# EAGLE design Dual 4-1 Mux (EAGLE 9.6.2)
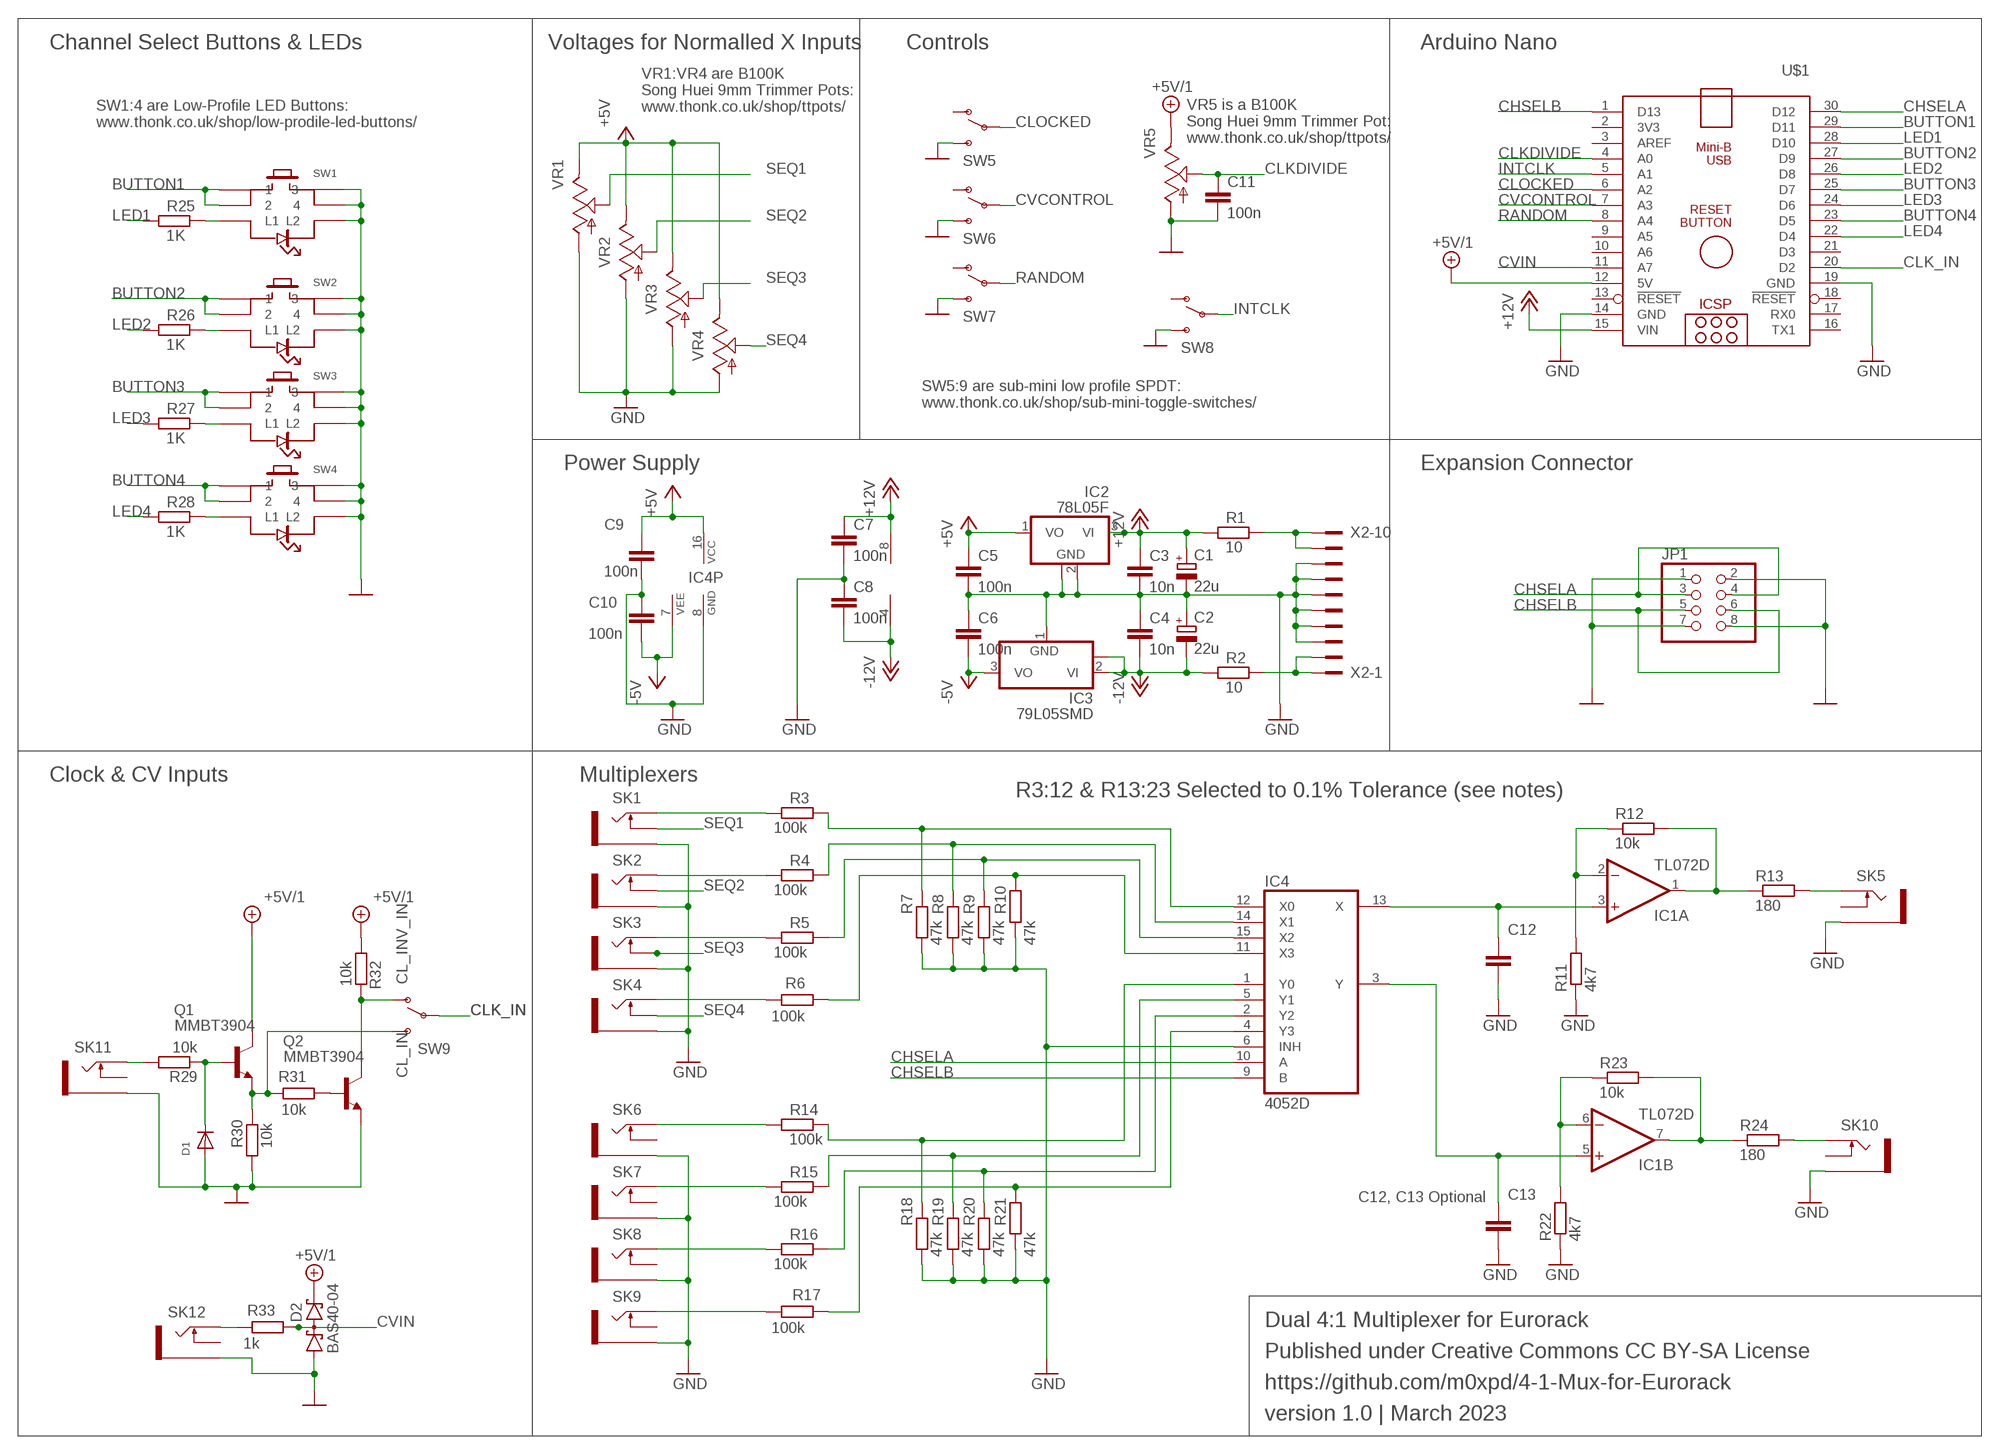
[diagram p0: schematic, sheet 1]

## Parts
C1  22u  CPOL-EU153CLV-0505  [153CLV-0505]
C2  22u  CPOL-EU153CLV-0505  [153CLV-0505]
C3  10n  C-EUC1206  [C1206]
C4  10n  C-EUC1206  [C1206]
C5  100n  C-EUC1206  [C1206]
C6  100n  C-EUC1206  [C1206]
C7  100n  C-EUC1206  [C1206]
C8  100n  C-EUC1206  [C1206]
C9  100n  C-EUC1206  [C1206]
C10  100n  C-EUC1206  [C1206]
C11  100n  C-EUC1206  [C1206]
C12  C-EUC1206  [C1206]
C13  C-EUC1206  [C1206]
D1  DIODESOD-323F  [SOD-323F]
D2  BAS40-04  [SOT23]
IC1  TL072D  [SO08]
IC2  78L05F  [SOT89]
IC3  79L05SMD  [SOT89]
IC4  4052D  [SO16]
JP1  PINHD-2X4  [2X04]
Q1  MMBT3904  [SOT23]
Q2  MMBT3904  [SOT23]
R1  10  R-EU_M1206  [M1206]
R2  10  R-EU_M1206  [M1206]
R3  100k  R-EU_M1206  [M1206]
R4  100k  R-EU_M1206  [M1206]
R5  100k  R-EU_M1206  [M1206]
R6  100k  R-EU_M1206  [M1206]
R7  47k  R-EU_M1206  [M1206]
R8  47k  R-EU_M1206  [M1206]
R9  47k  R-EU_M1206  [M1206]
R10  47k  R-EU_M1206  [M1206]
R11  4k7  R-EU_R1206  [R1206]
R12  10k  R-EU_R1206  [R1206]
R13  180  R-EU_M1206  [M1206]
R14  100k  R-EU_M1206  [M1206]
R15  100k  R-EU_M1206  [M1206]
R16  100k  R-EU_M1206  [M1206]
R17  100k  R-EU_M1206  [M1206]
R18  47k  R-EU_M1206  [M1206]
R19  47k  R-EU_M1206  [M1206]
R20  47k  R-EU_M1206  [M1206]
R21  47k  R-EU_M1206  [M1206]
R22  4k7  R-EU_R1206  [R1206]
R23  10k  R-EU_R1206  [R1206]
R24  180  R-EU_M1206  [M1206]
R25  1K  R-EU_M1206  [M1206]
R26  1K  R-EU_M1206  [M1206]
R27  1K  R-EU_M1206  [M1206]
R28  1K  R-EU_M1206  [M1206]
R29  10k  R-EU_R1206  [R1206]
R30  10k  R-EU_R1206  [R1206]
R31  10k  R-EU_R1206  [R1206]
R32  10k  R-EU_R1206  [R1206]
R33  1k  R-EU_M1206  [M1206]
SK1  THONKICONN_JACK  [WQP-PJ301M-12_JACK]
SK2  THONKICONN_JACK  [WQP-PJ301M-12_JACK]
SK3  THONKICONN_JACK  [WQP-PJ301M-12_JACK]
SK4  THONKICONN_JACK  [WQP-PJ301M-12_JACK]
SK5  THONKICONN_JACK  [WQP-PJ301M-12_JACK]
SK6  THONKICONN_JACK  [WQP-PJ301M-12_JACK]
SK7  THONKICONN_JACK  [WQP-PJ301M-12_JACK]
SK8  THONKICONN_JACK  [WQP-PJ301M-12_JACK]
SK9  THONKICONN_JACK  [WQP-PJ301M-12_JACK]
SK10  THONKICONN_JACK  [WQP-PJ301M-12_JACK]
SK11  THONKICONN_JACK  [WQP-PJ301M-12_JACK]
SK12  THONKICONN_JACK  [WQP-PJ301M-12_JACK]
SW1  THONK_LED_BUTTON  [LOW_PROFILE_BUTTON]
SW2  THONK_LED_BUTTON  [LOW_PROFILE_BUTTON]
SW3  THONK_LED_BUTTON  [LOW_PROFILE_BUTTON]
SW4  THONK_LED_BUTTON  [LOW_PROFILE_BUTTON]
SW5  SUBMINI_SPDT  [SUBMINI_TOGGLE]
SW6  SUBMINI_SPDT  [SUBMINI_TOGGLE]
SW7  SUBMINI_SPDT  [SUBMINI_TOGGLE]
SW8  SUBMINI_SPDT  [SUBMINI_TOGGLE]
SW9  SUBMINI_SPDT  [SUBMINI_TOGGLE]
U$1  ARDUINO_NANOARDUINO_NANO  [ARDUINO_NANO]
VR1  9MM_VERTICAL_POT  [9MM_SNAP-IN_POT]
VR2  9MM_VERTICAL_POT  [9MM_SNAP-IN_POT]
VR3  9MM_VERTICAL_POT  [9MM_SNAP-IN_POT]
VR4  9MM_VERTICAL_POT  [9MM_SNAP-IN_POT]
VR5  9MM_VERTICAL_POT  [9MM_SNAP-IN_POT]
X2  2510-  [PAK100/2500-10]

## Nets
+5V: C5.1 C9.1 IC2.1(VO) IC4.16(VCC) VR1.3(E) VR2.3(E) VR3.3(E) VR4.3(E)
+5V/1: D2.2(C2) Q1.3(C) R32.1 U$1.12(5V) VR5.3(E)
+12V: C1.+ C3.1 C7.1 IC1.8(P:V+) IC2.3(VI) R1.1 U$1.15(VIN)
-5V: C6.2 C10.2 IC3.3(VO) IC4.7(VEE)
-12V: C2.- C4.2 C8.2 IC1.4(P:V-) IC3.2(VI) IC3.2@1(VI) R2.1
BUTTON1: SW1.P$1 SW1.P$2 U$1.29(D11)
BUTTON2: SW2.P$1 SW2.P$2 U$1.27(D9)
BUTTON3: SW3.P$1 SW3.P$2 U$1.25(D7)
BUTTON4: SW4.P$1 SW4.P$2 U$1.23(D5)
CHSELA: IC4.10(A) JP1.3 JP1.4 U$1.30(D12)
CHSELB: IC4.9(B) JP1.5 JP1.6 U$1.1(D13)
CL_IN: Q1.2(E) R30.2 R31.2 SW9.3(S)
CL_INV_IN: Q2.3(C) R32.2 SW9.1(O)
CLK_IN: SW9.COM(COMMON) U$1.20(D2)
CLKDIVIDE: C11.1 U$1.4(A0) VR5.2(S)
CLOCKED: SW5.COM(COMMON) U$1.6(A2)
CVCONTROL: SW6.COM(COMMON) U$1.7(A3)
CVIN: D2.3(C1A2) R33.1 U$1.11(A7)
GND: C1.- C2.+ C3.2 C4.1 C5.2 C6.1 C7.2 C8.1 C9.2 C10.1 C11.2 C12.2 C13.2 D1.A D2.1(A1) IC2.2(GND) IC2.2@1(GND) IC3.1(GND) IC4.6(INH) IC4.8(GND) JP1.1 JP1.2 JP1.7 JP1.8 Q2.2(E) R7.1 R8.1 R9.1 R10.1 R11.1 R18.1 R19.1 R20.1 R21.1 R22.1 R30.1 SK1.P$3_SLEEVE(SLEEVE) SK2.P$3_SLEEVE(SLEEVE) SK3.P$3_SLEEVE(SLEEVE) SK4.P$3_SLEEVE(SLEEVE) SK5.P$3_SLEEVE(SLEEVE) SK6.P$3_SLEEVE(SLEEVE) SK7.P$3_SLEEVE(SLEEVE) SK8.P$3_SLEEVE(SLEEVE) SK9.P$3_SLEEVE(SLEEVE) SK10.P$3_SLEEVE(SLEEVE) SK11.P$3_SLEEVE(SLEEVE) SK12.P$3_SLEEVE(SLEEVE) SW1.L$2(L2) SW1.P$3 SW1.P$4 SW2.L$2(L2) SW2.P$3 SW2.P$4 SW3.L$2(L2) SW3.P$3 SW3.P$4 SW4.L$2(L2) SW4.P$3 SW4.P$4 SW5.3(S) SW6.3(S) SW7.3(S) SW8.3(S) U$1.14(GND) U$1.19(GND) VR1.1(A) VR2.1(A) VR3.1(A) VR4.1(A) VR5.1(A) X2.3 X2.4 X2.5 X2.6 X2.7 X2.8
INTCLK: SW8.COM(COMMON) U$1.5(A1)
LED1: R25.1 U$1.28(D10)
LED2: R26.1 U$1.26(D8)
LED3: R27.1 U$1.24(D6)
LED4: R28.1 U$1.22(D4)
N$1: IC4.12(X0) R3.2 R7.2
N$2: IC4.14(X1) R4.2 R8.2
N$3: IC4.15(X2) R5.2 R9.2
N$4: C12.1 IC1.3(A:+IN) IC4.13(X)
N$5: IC1.2(A:-IN) R11.2 R12.1
N$6: IC1.1(A:OUT) R12.2 R13.1
N$7: R3.1 SK1.P$1_TIP(TIP)
N$8: IC4.11(X3) R6.1 R10.2
N$9: R4.1 SK2.P$1_TIP(TIP)
N$10: R5.1 SK3.P$1_TIP(TIP)
N$11: R6.2 SK4.P$1_TIP(TIP)
N$12: R25.2 SW1.L$1(L1)
N$13: R13.2 SK5.P$1_TIP(TIP)
N$14: IC4.1(Y0) R14.2 R18.2
N$15: R1.2 X2.9 X2.10
N$16: R2.2 X2.1 X2.2
N$17: IC4.5(Y1) R15.2 R19.2
N$18: IC4.2(Y2) R16.2 R20.2
N$19: IC4.4(Y3) R17.1 R21.2
N$20: R14.1 SK6.P$1_TIP(TIP)
N$21: R15.1 SK7.P$1_TIP(TIP)
N$22: R16.1 SK8.P$1_TIP(TIP)
N$23: R17.2 SK9.P$1_TIP(TIP)
N$24: D1.C Q1.1(B) R29.1
N$25: C13.1 IC1.5(B:+IN) IC4.3(Y)
N$26: IC1.6(B:-IN) R22.2 R23.1
N$27: IC1.7(B:OUT) R23.2 R24.1
N$28: R24.2 SK10.P$1_TIP(TIP)
N$29: R26.2 SW2.L$1(L1)
N$30: R33.2 SK12.P$1_TIP(TIP)
N$31: Q2.1(B) R31.1
N$32: R27.2 SW3.L$1(L1)
N$33: R29.2 SK11.P$1_TIP(TIP)
N$34: R28.2 SW4.L$1(L1)
RANDOM: SW7.COM(COMMON) U$1.8(A4)
SEQ1: SK1.P$2_SWITCH(SWITCH) VR1.2(S)
SEQ2: SK2.P$2_SWITCH(SWITCH) VR2.2(S)
SEQ3: SK3.P$2_SWITCH(SWITCH) VR3.2(S)
SEQ4: SK4.P$2_SWITCH(SWITCH) VR4.2(S)
Unconnected: SK5.P$2_SWITCH(SWITCH) SK6.P$2_SWITCH(SWITCH) SK7.P$2_SWITCH(SWITCH) SK8.P$2_SWITCH(SWITCH) SK9.P$2_SWITCH(SWITCH) SK10.P$2_SWITCH(SWITCH) SK11.P$2_SWITCH(SWITCH) SK12.P$2_SWITCH(SWITCH) SW5.1(O) SW6.1(O) SW7.1(O) SW8.1(O) U$1.2(3V3) U$1.3(AREF) U$1.9(A5) U$1.10(A6) U$1.13(!RESET) U$1.16(TX1) U$1.17(RX0) U$1.18(!RESET) U$1.21(D3)

## Notes on the sheet
- Channel Select Buttons & LEDs | Voltages for Normalled X Inputs | Controls | Arduino Nano
- VR1:VR4 are B100K 
  Song Huei 9mm Trimmer Pots:
  www.thonk.co.uk/shop/ttpots/
- SW1:4 are Low-Profile LED Buttons:
  www.thonk.co.uk/shop/low-prodile-led-buttons/
- VR5 is a B100K 
  Song Huei 9mm Trimmer Pot:
  www.thonk.co.uk/shop/ttpots/
- SW5:9 are sub-mini low profile SPDT:
  www.thonk.co.uk/shop/sub-mini-toggle-switches/
- Power Supply | Expansion Connector
- Clock & CV Inputs | Multiplexers
- R3:12 & R13:23 Selected to 0.1% Tolerance (see notes)
- C12, C13 Optional
- Dual 4:1 Multiplexer for Eurorack
- Published under Creative Commons CC BY-SA License
- https://github.com/m0xpd/4-1-Mux-for-Eurorack
- version 1.0 | March 2023

## Library data of the parts
C1 C2 = rcl:CPOL-EU: POLARIZED CAPACITOR, European symbol; SPICEPREFIX: C
C3-C13 = rcl:C-EU: CAPACITOR, European symbol; SPICEPREFIX: C
D1 = adafruit:DIODE: Diode SMADIODE - SMA Surface Mount Package 20V 1A Schottky Diode Digikey: 641-1014-6-ND DO-1N4148 - Through Hole Small Current Diode SOD-123 20V 1 A (.5mV Vf) Schottky Diode - Digikey: MBRX120TPMSCT-ND SOD-323 10V 570mA (.38mV Vf, 3ns) Schottky Diode - Digikey: ZLLS410CT-ND SOD-523 30V 30mA Schottky Diode (RB751S-40TE61) - Digikey: RB751S-40TE61CT-ND SOT23-R/W - SOT23 Package (R = Solder Paste/Reflow Ovens, W = Hand-Soldering) BAT54Film 40V 300mA - Digikey: 497-7162-1-ND
D2 = diode:BAS40-04: Silicon Schottky Diodes General-purpose diode for high-speed switching
IC1 = linear:TL072: OP AMP
IC2 = linear:78L*: POSITOIV-VOLTAGE REGULATORS Output up to 100 mA Source: Datasheet <http://focus.ti.com/lit/ds/symlink/ua78l05.pdf>
IC3 = MyLibrary:79L05SMD: -5V Linear Regulator with 100mA output in SOT-89 Package
IC4 = 40xx:4052: Dual 4-channel ANALOG MULTIPLEXER
JP1 = pinhead:PINHD-2X4: PIN HEADER
Q1 Q2 = MyLibrary:MMBT3904: SMD Version of the 2N3904 in SOT23 Package
R1-R33 = rcl:R-EU_: RESISTOR, European symbol; SPICEPREFIX: R
SK1-SK12 = MyLibrary:THONKICONN_JACK
SW1-SW4 = MyLibrary:THONK_LED_BUTTON: Sleek low-profile illuminated button with a choice of LED colours https://www.thonk.co.uk/shop/low-profile-led-buttons/
SW5-SW9 = MyLibrary:SUBMINI_SPDT: Subminuature SPDT Toggle, THONK DW1
U$1 = MyLibrary:ARDUINO_NANO: Arduino Nano with un-cluttered footprint
VR1-VR5 = MyLibrary:9MM_VERTICAL_POT
X2 = con-3m:2510-: 3M (TM) Pak 100 4-Wall Header Source: 3M; MF: 3M; MPN: 2510-6002UB; OC_FARNELL: 9838244; OC_NEWARK: 46F4725

## Board
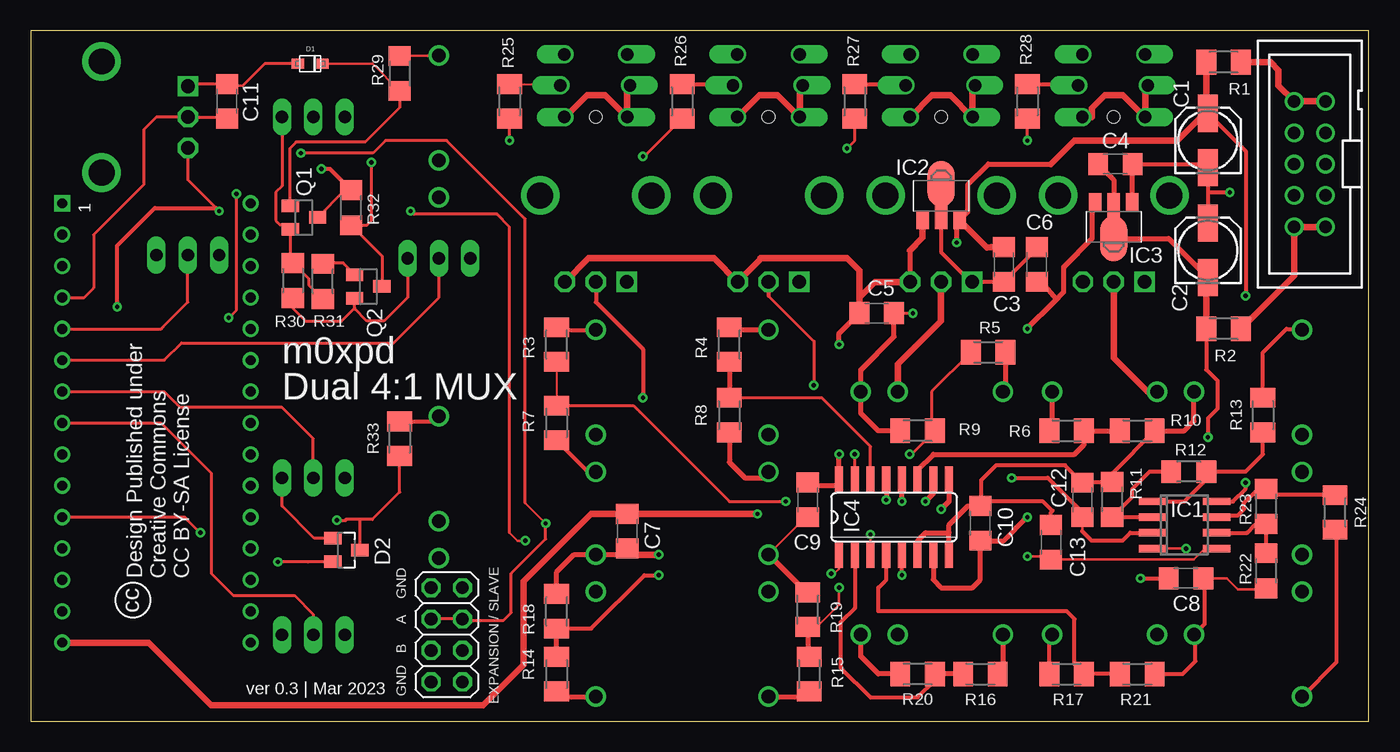
[diagram p1: board, top side]
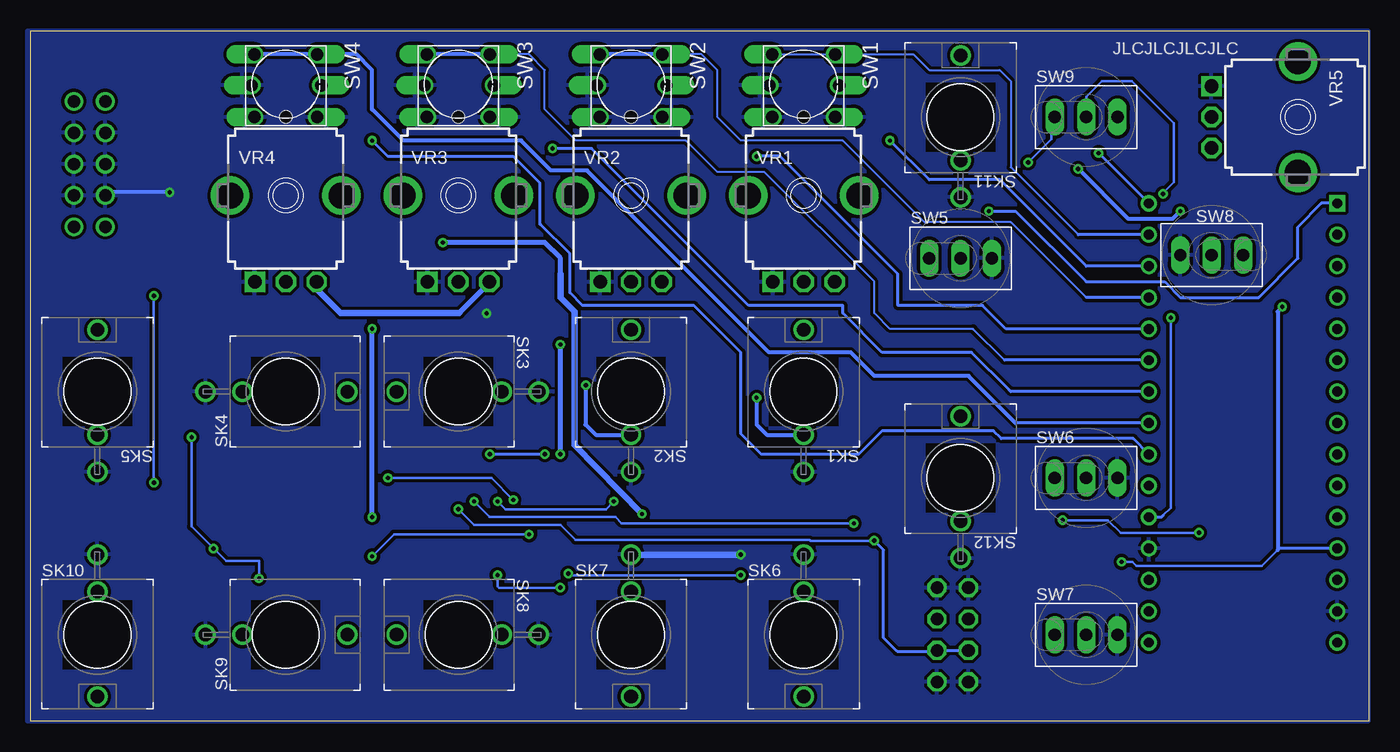
[diagram p2: board, bottom side, seen from below]

Size 108.25 x 55.87 mm. Coordinates in mm from the lower left corner, seen from the top.
Outline: 0,0 108.25,0 108.25,55.87 0,55.87 0,0
Copper layers (1*16): Top 0.035mm / dielectric 1.5mm / Bottom 0.035mm
Design rules "default *": minimum track width 6mil, minimum drill 0.35mm, track to track 10mil, track to pad 10mil, pad to pad 6mil, via to via 6mil, smd to smd 6mil, copper to edge 0mil, drill to drill 6mil, minimum pad ring 10mil, minimum via ring 8mil, stop-mask expansion 4mil, vias tented up to drill 0mil, thermal gap 10mil

### Footprints (pad centres in the part's own frame; a part is rotated, then mirrored left to right if it is on the bottom)
153CLV-0505 = smd 3 x 1.6: + 2.2,0; - -2.2,0
C1206 = smd 1.6 x 1.8: 1 -1.4,0; 2 1.4,0
SOD-323F = smd 1 x 0.8: A -1,0; C 1,0
SOT23 = smd 1 x 1.4: 1 -0.95,-1.1; 2 0.95,-1.1; 3 0,1.1
SO08 = smd 0.6 x 2.2: 1 -1.905,-2.6; 2 -0.635,-2.6; 3 0.635,-2.6; 4 1.905,-2.6; 5 1.905,2.6; 6 0.635,2.6; 7 -0.635,2.6; 8 -1.905,2.6
SOT89 = smd 1 x 1.5: 1 -1.499,-1.981; 3 1.499,-1.981 | smd 1 x 2: 2 0,-1.727 | smd 2.2 x 3.7: 2@1 0,0.94
SO16 = smd 0.66 x 2.032: 1 -4.445,-3.073; 2 -3.175,-3.073; 3 -1.905,-3.073; 4 -0.635,-3.073; 5 0.635,-3.073; 6 1.905,-3.073; 7 3.175,-3.073; 8 4.445,-3.073; 9 4.445,3.073; 10 3.175,3.073; 11 1.905,3.073; 12 0.635,3.073; 13 -0.635,3.073; 14 -1.905,3.073; 15 -3.175,3.073; 16 -4.445,3.073
2X04 = drill 1.016 octagon: 1 -3.81,-1.27; 2 -3.81,1.27; 3 -1.27,-1.27; 4 -1.27,1.27; 5 1.27,-1.27; 6 1.27,1.27; 7 3.81,-1.27; 8 3.81,1.27
M1206 = smd 1.6 x 2: 1 -1.4,0; 2 1.4,0
R1206 = smd 1.6 x 1.803: 1 -1.422,0; 2 1.422,0
WQP-PJ301M-12_JACK = drill 1.1: P$1_TIP 0,5; P$2_SWITCH 0,-3.5; P$3_SLEEVE 0,-6.5
LOW_PROFILE_BUTTON = drill 1 offset: L$1 -2.875,-0.02; L$2 2.76,-0.02; P$1 2.54,-2.54; P$2 -2.54,-2.54; P$3 2.54,2.54; P$4 -2.54,2.54 | hole 1: 0,2.54
SUBMINI_TOGGLE = drill 1 pad 1.422 long: 1 -2.54,0; 3 2.54,0; COM 0,0
ARDUINO_NANO = drill 0.8 square: 1 -20.32,-7.62 | drill 0.8: 2 -17.78,-7.62; 3 -15.24,-7.62; 4 -12.7,-7.62; 5 -10.16,-7.62; 6 -7.62,-7.62; 7 -5.08,-7.62; 8 -2.54,-7.62; 9 0,-7.62; 10 2.54,-7.62; 11 5.08,-7.62; 12 7.62,-7.62; 13 10.16,-7.62; 14 12.7,-7.62; 15 15.24,-7.62; 16 15.24,7.62; 17 12.7,7.62; 18 10.16,7.62; 19 7.62,7.62; 20 5.08,7.62; 21 2.54,7.62; 22 0,7.62; 23 -2.54,7.62; 24 -5.08,7.62; 25 -7.62,7.62; 26 -10.16,7.62; 27 -12.7,7.62; 28 -15.24,7.62; 29 -17.78,7.62; 30 -20.32,7.62
9MM_SNAP-IN_POT = drill 1.1 square: 1 -2.5,-7 | drill 1.1 octagon: 2 0,-7; 3 2.5,-7 | drill 2.1 pad 2.794: CH1 -4.5,0; CH2 4.5,0
PAK100/2500-10 = drill 1 pad 1.422: 1 -5.08,-1.27; 2 -5.08,1.27; 3 -2.54,-1.27; 4 -2.54,1.27; 5 0,-1.27; 6 0,1.27; 7 2.54,-1.27; 8 2.54,1.27; 9 5.08,-1.27; 10 5.08,1.27

### Placement (x,y rotation side)
C1  95.25,46.99 90 top
C2  95.25,38.1 90 top
C3  78.74,36.96 270 top
C4  87.76,45.09 180 top
C5  68.45,33.02 0 top
C6  81.41,36.96 270 top
C7  48.26,15.37 270 top
C8  93.47,11.56 180 top
C9  62.87,17.91 270 top
C10  76.83,16 270 top
C11  15.88,50.16 90 top
C12  85.09,17.9 90 top
C13  82.55,14.47 90 top
D1  22.61,53.21 0 top
D2  25.53,13.84 270 top
IC1  93.34,15.88 270 top
IC2  73.66,42.55 0 top
IC3  87.63,40.01 180 top
IC4  69.85,16.51 0 top
JP1  33.66,6.99 270 top
Q1  22.1,40.77 270 top
Q2  27.3,35.18 270 top
R1  96.52,53.34 0 top
R2  96.52,31.75 0 top
R3  42.55,30.48 270 top
R4  56.52,30.48 270 top
R5  77.47,29.84 180 top
R6  83.82,23.5 180 top
R7  42.55,24.13 90 top
R8  56.52,24.77 90 top
R9  71.75,23.5 0 top
R10  89.53,23.5 180 top
R11  87.5,17.93 270 top
R12  93.7,20.19 0 top
R13  99.69,24.77 90 top
R14  42.55,3.81 90 top
R15  62.99,3.81 90 top
R16  76.83,3.81 180 top
R17  83.82,3.81 180 top
R18  42.55,8.89 270 top
R19  62.87,9.02 270 top
R20  71.75,3.81 0 top
R21  89.53,3.81 180 top
R22  99.95,12.17 90 top
R23  99.95,17.37 90 top
R24  105.54,16.89 270 top
R25  38.73,50.16 90 top
R26  52.7,50.16 90 top
R27  66.67,50.16 90 top
R28  80.64,50.16 90 top
R29  29.84,52.43 90 top
R30  21.21,35.66 90 top
R31  23.62,35.59 270 top
R32  25.91,41.55 270 top
R33  29.84,22.86 90 top
SK1  45.72,26.67 0 bottom
SK2  59.69,26.67 0 bottom
SK3  73.66,26.67 90 bottom
SK4  87.63,26.67 270 bottom
SK5  102.87,26.67 0 bottom
SK6  45.72,6.99 180 bottom
SK7  59.69,6.99 180 bottom
SK8  73.66,6.99 90 bottom
SK9  87.63,6.99 270 bottom
SK10  102.87,6.99 180 bottom
SK11  33.02,48.9 0 bottom
SK12  33.02,19.68 0 bottom
SW1  45.72,51.44 180 bottom
SW2  59.69,51.44 180 bottom
SW3  73.66,51.44 180 bottom
SW4  87.63,51.44 180 bottom
SW5  33.02,37.47 0 bottom
SW6  22.86,19.68 0 bottom
SW7  22.86,6.99 0 bottom
SW8  12.7,37.72 180 bottom
SW9  22.86,48.9 0 bottom
U$1  10.16,21.59 270 top
VR1  45.72,42.55 0 bottom
VR2  59.69,42.55 0 bottom
VR3  73.66,42.55 0 bottom
VR4  87.63,42.55 0 bottom
VR5  5.71,48.9 270 bottom
X2  103.5,45.09 90 top

### Tracks (layer width: path | path; a pad name or v marks a point on that pad's centre or on a via)
+5V  (via drill 0.35)
  Top 0.406: 71.12,38.1 71.12,35.59 VR3.3 | C5.1 65.41,31.38 v65.41,30.48 | 65.41,19.94 v65.41,21.59 | C9.1 63.12,19.05 65.41,19.05
  Top 0.508: VR3.3 68.31,35.55 67.05,34.29 C5.1 67.05,36.45 66.04,37.47 59.05,37.47 59.05,37.41 VR2.3 55.27,37.47 45.14,37.47 VR1.3 | IC2.1 72.16,39.14 71.12,38.1 | 65.41,19.94 IC4.16 65.41,19.05
  Bottom 0.406: 73.61,33.02 71.16,35.47 VR3.3 | v65.41,21.59 v65.41,30.48
  Bottom 0.508: VR4.3 85.13,34.97 83.19,33.02 73.61,33.02
+5V/1  (via drill 0.35)
  Top 0.152: 22.42,12.89 22.41,12.88 | 25.41,42.98 R32.1
  Top 0.203: 14.99,41.53 v15.24,41.27 | 25.87,43.01 R32.1 | 20.12,13.01 v19.99,12.88
  Top 0.254: v15.24,41.27 12.71,43.8 VR5.3 | 22.41,12.88 v19.99,12.88 | D2.2 22.42,12.89 | Q1.3 25.41,42.98
  Top 0.305: v6.99,33.53 6.99,38.48 10.03,41.53 14.99,41.53 | v23.5,44.7 24.18,44.7 25.87,43.01
  Bottom 0.203: v19.99,12.88 19.11,12.88 18.8,12.57 8.64,12.57 7.37,13.84
  Bottom 0.254: U$1.12 7.24,13.97 7.37,13.84
  Bottom 0.305: 7.37,13.84 7.37,33.15 v6.99,33.53 | v15.24,41.27 15.88,40.64 19.43,40.64 v23.5,44.7
+12V  (via drill 0.35)
  Top 0.152: 74.93,40.34 IC2.3
  Top 0.305: C1.+ 98.3,46.14 v98.3,34.42 | IC1.8 97.28,17.78 98.3,18.8 v98.3,19.3
  Top 0.406: 82.55,45.09 77.47,45.09 75.79,43.41 75.79,41.2 IC2.3 | v74.93,38.73 74.93,40.34
  Top 0.508: R1.1 95.12,49.32 | 95.12,49.32 C1.+ | 82.55,45.09 84.45,46.99 92.79,46.99 95.12,49.32 | IC2.3 77.38,38.34 77.72,38.36 C3.1 | v58.8,16.77 C7.1 45.34,16.77 39.88,11.3 39.88,4.57 36.58,1.27 14.61,1.27 9.53,6.35 U$1.15
  Bottom 0.203: v98.3,34.42 v98.3,19.3
  Bottom 0.406: 65.41,36.2 65.41,37.47 66.67,38.73 v74.93,38.73
  Bottom 0.508: 65.41,36.2 65.41,34.29 64.26,33.15 64.26,22.37 v58.8,16.77
-5V  (via drill 0.35)
  Top 0.406: IC3.3 85.88,41.73 85.88,39.06 83.58,36.77 83.57,36.78 83.57,34.72 82.78,33.93 | C6.2 81.89,35.48 83,34.16 82.78,33.93 | v80.64,16.51 78.74,14.61 C10.2 76.83,11.43 76.2,10.79 73.66,10.79 73.03,11.43 IC4.7 | 82.78,33.93 80.64,31.8 v80.64,31.75
  Bottom 0.406: v80.64,16.51 v80.64,31.75
-12V  (via drill 0.35)
  Top 0.203: v95.25,22.99 95.25,22.86 | v93.47,13.97 IC1.4
  Top 0.305: R2.1 95.12,28.45 96.01,27.56 96.01,25.27 95.25,24.51 v95.25,22.99 | v89.79,11.56 C8.2
  Top 0.406: C2.- 92.08,39.06 IC3.2@1 IC3.2 87.63,43.81 C4.2
  Top 0.508: R2.1 95.12,35.77 C2.-
  Bottom 0.203: v95.25,22.99 95.25,15.75 v93.47,13.97 92.46,12.95 89.79,12.95 v89.79,11.56
BUTTON1
  Bottom 0.152: SW1.P$1 SW1.P$2 36.83,53.98 35.56,52.7 29.84,52.7 28.96,51.82 28.96,44.83 23.5,39.37
  Bottom 0.254: U$1.29 23.5,39.37
BUTTON2
  Bottom 0.152: 22.86,34.29 28.96,40.39 35.94,40.39 42.55,46.99 50.8,46.99 52.7,48.9 52.7,52.7 53.98,53.98 SW2.P$2
  Bottom 0.254: U$1.27 22.86,34.29
  Bottom 0.305: SW2.P$2 SW2.P$1
BUTTON3
  Bottom 0.152: 32,31.75 38.73,31.75 40.01,33.02 40.01,35.56 48.9,44.45 52.7,44.45 55.24,46.99 64.14,46.99 66.67,49.53 66.67,52.7 67.94,53.98 SW3.P$2
  Bottom 0.203: 29.46,29.21 32,31.75
  Bottom 0.254: U$1.25 29.46,29.21
  Bottom 0.305: SW3.P$2 SW3.P$1
BUTTON4
  Bottom 0.254: U$1.23 28.57,24.13
  Bottom 0.305: 28.57,24.13 32.38,27.94 40.01,27.94 41.91,29.84 48.51,29.84 63.25,44.58 66.17,44.58 68.58,46.99 78.11,46.99 80.64,49.53 80.64,52.7 81.92,53.98 SW4.P$2 SW4.P$1
CHSELA  (via drill 0.35)
  Top 0.152: 35.05,8.13 JP1.4
  Top 0.203: v41.66,16 40.01,17.65
  Top 0.254: 40.01,17.65 40.01,40.64 33.66,46.99 28.7,46.99 27.69,45.97 v21.84,45.97 | v41.66,16 41.66,14.73 38.86,11.94 38.86,8.76 38.23,8.13 35.05,8.13 | JP1.4 JP1.3
  Top 0.406: IC4.10 73.03,18.41 v72.39,17.78
  Bottom 0.203: v72.39,17.78 71.12,16.51 60.96,16.51 60.45,16 v41.66,16
  Bottom 0.254: U$1.30 v21.84,45.97
CHSELB  (via drill 0.35)
  Top 0.203: v40.01,14.61 39.37,14.61 38.73,15.24
  Top 0.254: 38.73,15.24 38.73,40.01 37.72,41.02 30.99,41.02 v30.73,41.27
  Top 0.406: IC4.9 74.3,17.78 v73.66,17.14
  Bottom 0.152: 38.1,5.59 38.16,5.65 | 34.99,5.65 JP1.6
  Bottom 0.203: v73.66,17.14 72.39,15.88 65.41,15.88 64.2,14.67 45.23,14.67 45.17,14.61 v40.01,14.61
  Bottom 0.254: v30.73,41.27 28.57,41.27 22.86,35.56 16.51,35.56 15.24,34.29 8.89,34.29 5.71,37.47 5.71,40.01 3.81,41.91 U$1.1 | v40.01,14.61 39.24,13.84 39.24,6.73 38.16,5.65 34.99,5.65 | JP1.6 JP1.5
CL_IN
  Top 0.152: 21,37.55 21.34,37.21
  Top 0.203: 21.53,37.41 21.34,37.21 R30.2
  Top 0.254: R30.2 22.48,35.81 22.48,35.31 R31.2 | SW9.3 20.32,43.31 19.81,42.8 19.81,40.51 20,40.32 20.13,40.2 20.62,40.2 Q1.2 21,37.55
CL_INV_IN  (via drill 0.35)
  Top 0.254: v27.56,45.21 27.56,40.51 27.18,40.13 R32.2 28.41,37.63 Q2.3
  Bottom 0.203: SW9.1 25.65,48.64 25.65,47.12 v27.56,45.21
CLK_IN  (via drill 0.35)
  Top 0.203: v16.64,42.67 16.68,42.71
  Top 0.254: v16,32.64 16.64,33.27 v16.64,42.67
  Bottom 0.203: 16.64,16.64 16,17.27 v16,32.64 | v16.64,42.67 16.64,42.76 15.77,43.62 15.77,48.41 19.18,51.82 21.59,51.82 22.86,50.55 SW9.COM
  Bottom 0.254: 16.64,16.64 16.76,16.51 U$1.20
CLKDIVIDE
  Top 0.203: 15.74,48.9 C11.1
  Top 0.254: 15.74,48.9 VR5.2 10.16,48.9 9.14,47.88 9.14,43.43 5.08,39.37 5.08,35.05 4.32,34.29 U$1.4
CLOCKED
  Top 0.254: SW5.COM 33.02,34.29 29.34,30.61 12.19,30.61 10.79,29.21 U$1.6
CVCONTROL
  Top 0.254: SW6.COM 22.86,22.86 20.32,25.4 12.06,25.4 10.79,26.67 U$1.7
CVIN  (via drill 0.35)
  Top 0.152: 26.63,16.27 26.67,16.31
  Top 0.203: v13.72,15.24 | 25.53,16.26 25.47,16.31
  Top 0.254: R33.1 29.84,18.54 27.61,16.31 26.67,16.31 25.47,16.31 | v13.72,15.24 12.57,16.38 12.45,16.51 U$1.11 | v24.77,16.26 25.53,16.26 | D2.3 26.63,16.27
  Bottom 0.203: v13.72,15.24 20.07,15.24 21.08,16.26 v24.77,16.26
GND  (via drill 0.35)
  Top 0.152: C3.2 78.72,35.55 | 80.9,37.72 80.9,38.1 81.16,38.36 C6.1 | C7.2 48.77,13.46
  Top 0.203: SK7.P$3_SLEEVE 62.72,16.51 C9.2 | C12.2 85.14,19.35 | 87.5,20.06 R11.1 | 82.55,16.89 82.68,17.02 | 77.08,17.78 76.89,17.59 76.71,17.41 | C8.1 95,11.56 96.77,11.56 97.66,10.67 99.87,10.67 R22.1 | SK9.P$3_SLEEVE 94.25,7.1 | R30.1 21.21,33.4 | 12.88,51.56 VR5.1 | 17.14,51.44 16,51.44 C11.2
  Top 0.254: 21.21,33.4 22.23,32.38 25.15,32.38 26.23,33.47 26.23,33.33 | C11.2 12.88,51.56 | D1.A 18.92,53.21 17.14,51.44 | SW5.3 30.48,34.29 28.57,32.38 27.18,32.38 26.23,33.33 | 76.09,35.55 VR3.1 | C5.2 v71.37,33.02 | D2.1 22.93,14.79 20.32,17.4 SW6.3 | 26.23,33.33 26.2,33.36 Q2.2
  Top 0.305: R7.1 45.1,20.17 SK1.P$3_SLEEVE | 85.14,19.35 R11.1 | R10.1 87.5,20.06 | C13.2 82.55,16.89 | 82.68,17.02 81.92,17.78 77.08,17.78 | C12.2 83.69,20.7 78.11,20.7 76.89,19.49 76.89,17.59 | 95,11.56 95,7.85 94.25,7.1 94.25,4.84 93.22,3.81 R21.1 | IC2.2 73.66,37.97 76.09,35.55 78.72,35.55 | C4.1 94.95,45.09 C1.- 95.25,42.67 | 95.25,42.67 C2.+ | 95.25,42.67 95.38,42.8 v97.03,42.8 | C3.2 80.9,37.72
  Top 0.406: IC3.1 89.13,45.05 C4.1 | IC4.8 74.3,15.24 | 74.3,15.24 74.3,15.88 75.83,17.41 76.71,17.41 C10.1 | R18.1 42.55,12.06 43.97,13.48 SK6.P$3_SLEEVE 47.56,13.48 C7.2 | SK7.P$3_SLEEVE 62.76,10.42 R19.1 | R20.1 68.58,3.81 67.16,5.23 SK8.P$3_SLEEVE | IC4.6 71.75,14.61 72.39,15.24 74.3,15.24 | R8.1 56.52,20.95 57.78,19.68 59.2,19.68 SK2.P$3_SLEEVE | R9.1 68.58,23.5 67.16,24.91 SK3.P$3_SLEEVE 67.16,28.43 69.85,31.11 C5.2 | R10.1 93.34,23.5 94.13,24.28 SK4.P$3_SLEEVE | IC2.2 IC2.2@1
  Top 0.508: SW4.P$4 85.86,48.9 85.86,49.63 86.9,50.66 88.36,50.66 90.13,48.9 SW4.P$3 90.17,51.23 SW4.L$2 | SW3.P$4 71.16,48.9 72.93,50.66 74.39,50.66 76.16,48.9 SW3.P$3 76.2,51.23 SW3.L$2 | SW2.P$4 57.19,48.9 58.96,50.66 60.42,50.66 62.19,48.9 SW2.P$3 62.23,51.23 SW2.L$2 | SW1.P$4 43.22,48.9 44.99,50.66 46.45,50.66 48.22,48.9 SW1.P$3 48.26,51.23 SW1.L$2 | 48.77,13.46 v50.8,13.46
  Bottom 0.152: 59.67,13.46 SK7.P$3_SLEEVE | 33.02,13.08 SK12.P$3_SLEEVE
  Bottom 0.305: v97.03,42.8 101.98,42.8 X2.4
  Bottom 0.508: v50.8,13.46 59.67,13.46
  pour Bottom: 0,0 0,55.88 108.58,55.88 108.58,0
INTCLK
  Top 0.254: SW8.COM 12.7,33.91 10.67,31.88 10.54,31.75 U$1.5
LED1  (via drill 0.35)
  Top 0.254: v38.73,46.99 R25.1
  Bottom 0.254: v38.73,46.99 35.56,43.81 29.84,43.81 22.86,36.83 U$1.28
LED2  (via drill 0.35)
  Top 0.152: 49.66,45.72 v49.53,45.72
  Top 0.254: 49.66,45.72 R26.1
  Bottom 0.254: v49.53,45.72 47.62,45.72 38.1,36.2 38.1,33.66 31.24,33.66 29.34,31.75 U$1.26
LED3  (via drill 0.35)
  Top 0.254: v66.04,46.35 66.67,46.99 R27.1
  Bottom 0.254: v66.04,46.35 62.87,46.35 50.16,33.66 42.55,33.66 42.55,33.02 39.37,29.84 32.13,29.84 29.08,26.8 28.96,26.67 U$1.24
LED4  (via drill 0.35)
  Top 0.254: v80.64,46.99 R28.1
  Bottom 0.254: v80.64,46.99 79.38,45.72 69.22,45.72 67.06,43.56 67.06,40.2 66.99,40.2 64.64,37.85 64.64,34.68 63.62,33.66 54.61,33.66 50.8,29.84 50.8,23.24 49.15,21.59 41.27,21.59 39.37,23.5 30.35,23.5 29.72,22.86 19.05,22.86 U$1.22
N$1  (via drill 0.35)
  Top 0.152: R3.2 R7.2
  Top 0.254: R7.2 48.77,25.53 56.52,17.78 v61.09,17.78
  Top 0.406: v70.48,17.78 IC4.12
  Bottom 0.203: v61.09,17.78 61.72,17.14 69.85,17.14 v70.48,17.78
N$2
  Top 0.254: IC4.14 67.94,22.23 64,26.16 R8.2
  Top 0.406: R4.2 R8.2
N$3  (via drill 0.35)
  Top 0.254: R5.2 72.89,26.67 72.89,23.23 | IC4.15 v66.67,21.59 | R9.2 71.25,21.59
  Top 0.406: 72.89,23.23 R9.2 | v71.12,21.59 71.25,21.59
  Bottom 0.254: v66.67,21.59 v71.12,21.59
N$4  (via drill 0.35)
  Top 0.203: 85.09,16.89 C12.1 85.09,15.36
  Top 0.305: 85.09,16.89 82.29,19.68 v79.38,19.68 | 85.09,15.36 85.85,14.61 88.33,14.61 88.97,15.24 IC1.3
  Top 0.406: IC4.13 v69.22,17.91
  Bottom 0.203: v69.22,17.91 70.99,19.68 v79.38,19.68
N$5
  Top 0.305: IC1.2 R11.2 89.15,18.16 89.15,18.8 90.55,20.19 R12.1
N$6
  Top 0.203: R12.2 95.12,19.56
  Top 0.305: IC1.1 93.34,17.78 95.12,19.56 | R12.2 98.3,20.19 99.69,21.59 R13.1
N$7
  Top 0.152: R3.1 42.76,31.67
  Top 0.305: 42.76,31.67 SK1.P$1_TIP
N$8
  Top 0.406: R10.2 R6.1 85.22,22.36 84.45,21.59 73.03,21.59 71.75,20.32 IC4.11
N$9
  Top 0.406: SK2.P$1_TIP 56.73,31.67 R4.1
N$10
  Top 0.406: SK3.P$1_TIP 78.87,26.88 R5.1
N$11
  Top 0.406: SK4.P$1_TIP 82.63,23.7 R6.2
N$12
  Top 0.152: R25.2 42.73,51.56 SW1.L$1
N$13
  Top 0.305: R13.2 99.69,29.84 101.6,31.75 102.79,31.75 SK5.P$1_TIP
N$14  (via drill 0.35)
  Top 0.203: IC4.1 65.41,12.32 65.02,11.94 v64.77,11.94
  Top 0.305: R18.2 45.34,7.49 49.66,11.81 v50.8,11.81
  Top 0.406: R14.2 R18.2
  Bottom 0.203: v64.77,11.94 64.64,11.81 v50.8,11.81
N$15
  Top 0.508: X2.9 X2.10 100.97,51.44 100.97,52.7 100.33,53.34 R1.2
N$16
  Top 0.508: X2.1 X2.2 102.23,36.06 R2.2
N$17  (via drill 0.35)
  Top 0.203: R19.2 63.62,7.62 65.41,9.4 v65.41,10.79
  Top 0.305: v70.48,11.81 IC4.5
  Top 0.406: R15.2 62.87,5.34 R19.2
  Bottom 0.203: v65.41,10.79 70.36,10.79 70.48,10.92 v70.48,11.81
N$18
  Top 0.203: 73.16,3.31 R20.2
  Top 0.305: IC4.2 66.67,9.14 65.53,8 65.53,4.32 67.94,1.91 71.75,1.91 73.16,3.31
  Top 0.406: R16.2 R20.2
N$19
  Top 0.203: 85.09,3.94 84.45,4.58
  Top 0.254: R17.1 85.09,3.94
  Top 0.305: 84.45,4.58 84.45,8.26 83.82,8.89 68.58,8.89 68.58,10.79 69.22,11.43 IC4.4 | R21.2 R17.1
N$20
  Top 0.406: SK6.P$1_TIP 45.64,1.91 43.05,1.91 R14.1
N$21
  Top 0.406: SK7.P$1_TIP 62.57,1.99 R15.1
N$22
  Top 0.406: SK8.P$1_TIP 78.66,4.24 R16.1
N$23
  Top 0.305: R17.2 82.42,6.78 SK9.P$1_TIP
N$24
  Top 0.152: 20.95,41.76 Q1.1
  Top 0.203: R29.1 27.64,53.21 D1.C
  Top 0.254: R29.1 29.84,49.66 27.05,46.86 21.46,46.86 20.95,46.35 20.95,41.76
N$25  (via drill 0.35)
  Top 0.203: IC4.3 v67.94,15.11 | v80.64,13.34 82.29,13.34 C13.1 94.1,13.07 95,13.97 IC1.5
  Bottom 0.203: v67.94,15.11 78.87,15.11 v80.64,13.34
N$26
  Top 0.203: R23.1 99.95,15.88
  Top 0.305: R22.2 99.95,15.88 99.06,15.88 98.42,15.24 IC1.6
N$27
  Top 0.203: 100.45,18.29 100.08,18.67 | 100.08,18.67 R23.2 | IC1.7 96.07,16.64 | 99.19,18.67 100.08,18.67
  Top 0.305: R24.1 100.45,18.29 | 96.07,16.64 97.66,16.64 98.17,17.14 98.17,17.65 99.19,18.67
N$28
  Top 0.203: 105.66,15.36 R24.2
  Top 0.305: SK10.P$1_TIP 105.66,4.78 105.66,15.36
N$29
  Top 0.152: 56.7,51.56 SW2.L$1
  Top 0.305: R26.2 56.7,51.56
N$30
  Top 0.305: R33.2 32.59,24.26 SK12.P$1_TIP
N$31
  Top 0.254: Q2.1 25.27,37.06 25.27,37.08 23.7,37.08 R31.1
N$32
  Top 0.152: 70.67,51.56 SW3.L$1
  Top 0.305: R27.2 70.67,51.56
N$33
  Top 0.203: SK11.P$1_TIP 32.97,53.85 R29.2
N$34
  Top 0.152: 84.64,51.56 SW4.L$1
  Top 0.305: R28.2 84.64,51.56
RANDOM
  Top 0.254: SW7.COM 22.86,8.64 21.34,10.16 16.38,10.16 14.61,11.94 14.61,20.07 10.54,24.13 U$1.8
SEQ1  (via drill 0.35)
  Top 0.305: v49.53,26.16 49.53,30.1 45.72,33.91 VR1.2
  Bottom 0.305: v49.53,26.16 49.53,24 48.7,23.17 SK1.P$2_SWITCH
SEQ2  (via drill 0.35)
  Top 0.254: 59.69,34.42 63.37,30.73 63.37,27.18
  Top 0.305: VR2.2 59.69,34.42 | 63.37,27.18 v63.35,27.18
  Bottom 0.305: v63.35,27.18 63.35,24.03 63.37,24 62.54,23.17 SK2.P$2_SWITCH
SEQ3
  Top 0.508: SK3.P$2_SWITCH 70.16,28.89 73.66,32.38 VR3.2
SEQ4
  Top 0.508: SK4.P$2_SWITCH 90.37,26.67 87.63,29.41 VR4.2

### Text on the board
tPlace: Design Published under / Creative Commons / CC BY-SA License | cc
tNames: m0xpd | Dual 4:1 MUX | ver 0.3 | Mar 2023 | GND B A GND | EXPANSION / SLAVE
bNames: JLCJLCJLCJLC